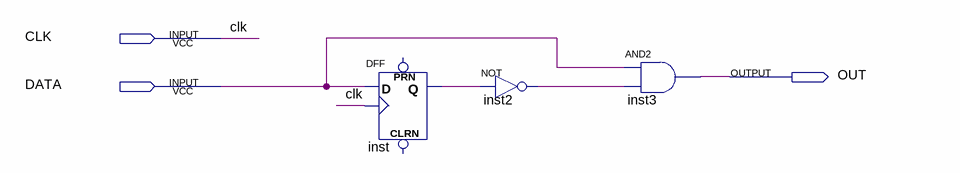
[diagram p0: schematic sheet]
// Quartus schematic RisingEdge.bdf as structural Verilog: 3 symbols, 3 pins
module RisingEdge (
  input  CLK,
  input  DATA,
  output OUT
);

  wire inst2_out, inst_q;

  DFF inst (.CLK(CLK), .D(DATA), .Q(inst_q));  // open: CLRN, PRN
  not inst2 (inst2_out, inst_q);
  and inst3 (OUT, DATA, inst2_out);
endmodule
